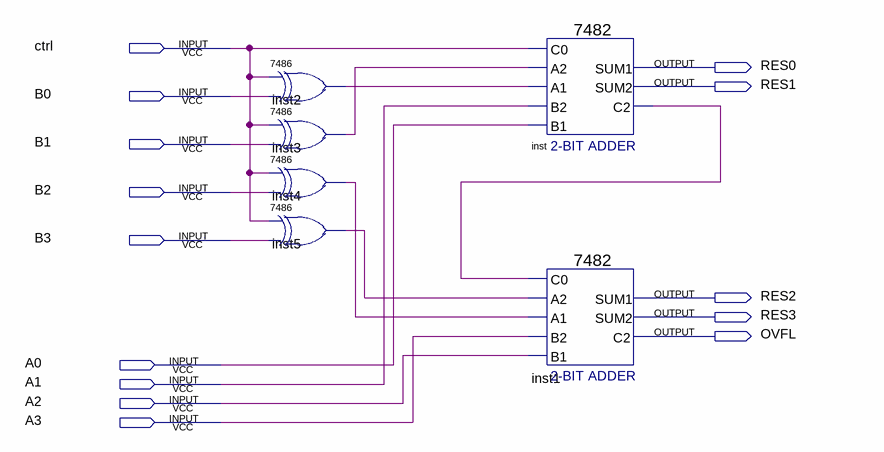
[diagram p0: schematic sheet]
// Quartus schematic nadd4.bdf as structural Verilog: 6 symbols, 14 pins
module nadd4 (
  input  ctrl,
  input  B0,
  input  B1,
  input  B2,
  input  B3,
  input  A0,
  input  A1,
  input  A2,
  input  A3,
  output RES0,
  output RES1,
  output RES2,
  output RES3,
  output OVFL
);

  wire inst2_1, inst3_1, inst4_1, inst5_1, inst_c2;

  \7486  inst2 (.\2 (ctrl), .\3 (B0), .\1 (inst2_1));
  \7486  inst3 (.\2 (ctrl), .\3 (B1), .\1 (inst3_1));
  \7486  inst4 (.\2 (ctrl), .\3 (B2), .\1 (inst4_1));
  \7486  inst5 (.\2 (ctrl), .\3 (B3), .\1 (inst5_1));
  \7482  inst (.A2(inst3_1), .B2(A1), .B1(A0), .C0(ctrl), .A1(inst2_1), .C2(inst_c2), .SUM1(RES0), .SUM2(RES1));
  \7482  inst1 (.A2(inst5_1), .B2(A3), .B1(A2), .C0(inst_c2), .A1(inst4_1), .C2(OVFL), .SUM1(RES2), .SUM2(RES3));
endmodule
